# Altium schematic sheet ReflectanceDigital.SchDoc
size A4; SheetNumber: 1; SheetTotal: 1
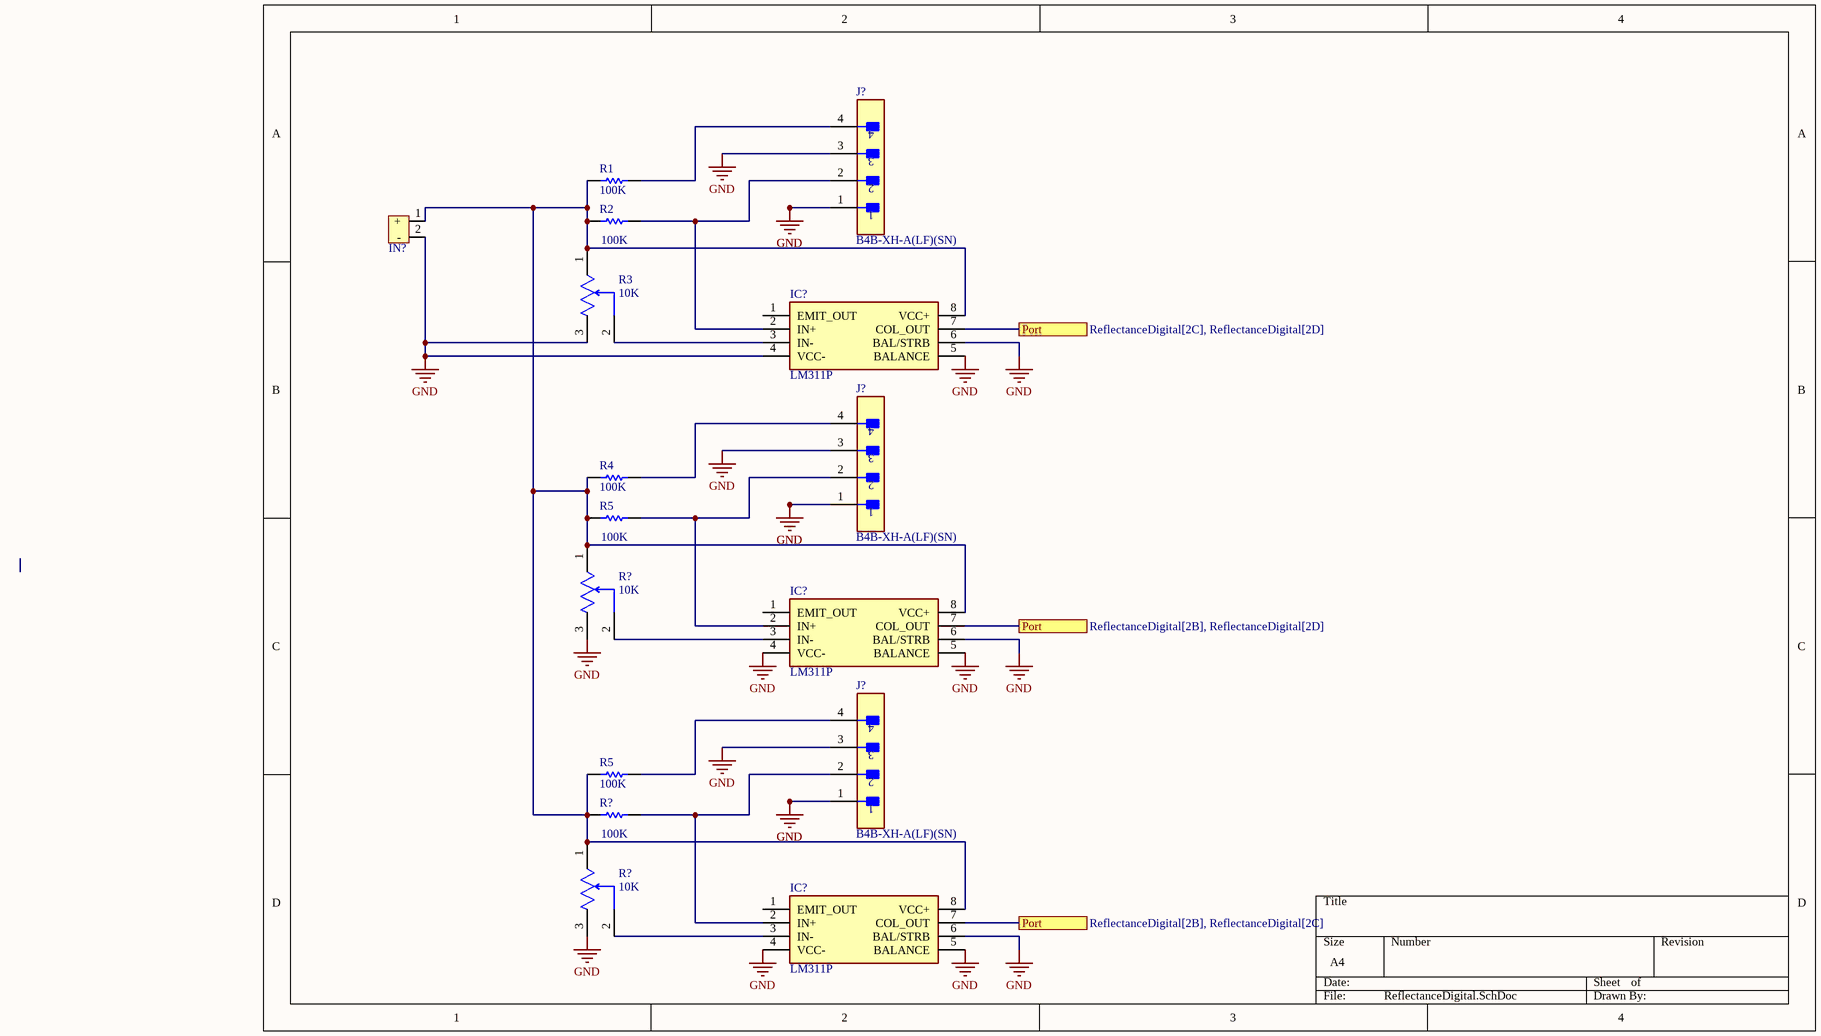
[diagram p0: ReflectanceDigital.SchDoc]

## Parts
(Parts that share a designator on the sheet are numbered #1, #2 ... from top to bottom, then left to right.)
IC?#1  LM311P  [DIP794W53P254L959H508Q8N]
IC?#2  LM311P  [DIP794W53P254L959H508Q8N]
IC?#3  LM311P  [DIP794W53P254L959H508Q8N]
IN?  Header  [Header]  (value not drawn)
J?#1  B4B-XH-A(LF)(SN)  [FP-B4B-XH-A_LF_SN-MFG]
J?#2  B4B-XH-A(LF)(SN)  [FP-B4B-XH-A_LF_SN-MFG]
J?#3  B4B-XH-A(LF)(SN)  [FP-B4B-XH-A_LF_SN-MFG]
R1  100K  [RESA60-630X240]
R2  100K  [RESA60-630X240]
R3  10K  [FP-3296W-MFG]
R4  100K  [RESA60-630X240]
R5#1  100K  [RESA60-630X240]
R5#2  100K  [RESA60-630X240]
R?#1  10K  [FP-3296W-MFG]
R?#2  100K  [RESA60-630X240]
R?#3  10K  [FP-3296W-MFG]

## Ports
Port (see ReflectanceDigital[2B], ReflectanceDigital[2C]), Port (see ReflectanceDigital[2B], ReflectanceDigital[2D]), Port (see ReflectanceDigital[2C], ReflectanceDigital[2D])

## Nets
GND: IC?#1.4(VCC-) IC?#1.5(BALANCE) IC?#1.6(BAL/STRB) IC?#2.4(VCC-) IC?#2.5(BALANCE) IC?#2.6(BAL/STRB) IC?#3.4(VCC-) IC?#3.5(BALANCE) IC?#3.6(BAL/STRB) IN?.2(-) J?#1.1 J?#1.3 J?#2.1 J?#2.3 J?#3.1 J?#3.3 R3.3(CW) R?#1.3(CW) R?#3.3(CW)
Port: IC?#1.7(COL_OUT) IC?#2.7(COL_OUT) IC?#3.7(COL_OUT) ; port Port
NetIC?#1_2: IC?#1.2(IN+) J?#1.2 R2.2
NetIC?#1_3: IC?#1.3(IN-) R3.2(WIPER)
NetIC?#1_8: IC?#1.8(VCC+) IC?#2.8(VCC+) IC?#3.8(VCC+) IN?.1(+) R1.1 R2.1 R3.1(CCW) R4.1 R5#1.1 R5#2.1 R?#1.1(CCW) R?#2.1 R?#3.1(CCW)
NetIC?#2_2: IC?#2.2(IN+) J?#2.2 R5#1.2
NetIC?#2_3: IC?#2.3(IN-) R?#1.2(WIPER)
NetIC?#3_2: IC?#3.2(IN+) J?#3.2 R?#2.2
NetIC?#3_3: IC?#3.3(IN-) R?#3.2(WIPER)
NetJ?#1_4: J?#1.4 R1.2
NetJ?#2_4: J?#2.4 R4.2
NetJ?#3_4: J?#3.4 R5#2.2

Not connected (* = marked no-connect by the designer): IC?#1 1(EMIT_OUT); IC?#2 1(EMIT_OUT); IC?#3 1(EMIT_OUT)

## Library data of the parts
IC?#1-IC?#3 = LM311P: Integrated Circuit; Manufacturer_Name: Texas Instruments; Datasheet Link: http://www.ti.com/lit/ds/symlink/lm311.pdf; Height: 5.08mm; Manufacturer_Part_Number: LM311P; Mouser Part Number: 595-LM311P; Mouser Price/Stock: https://www.mouser.co.uk/ProductDetail/Texas-Instruments/LM311P?qs=0OT4q4QBUTKsKDe9sMZxLw%3D%3D; Arrow Part Number: LM311P; Arrow Price/Stock: https://www.arrow.com/en/products/lm311p/texas-instruments?region=nac
J?#1-J?#3 = CMP-17439-000250-1: CONN HEADER VERT 4POS 2.5MM; Number of Contacts: 4; Contact Resistance: 20mR; Voltage Rating: 250V; Max Current Rating: 3A; Gender: Male; Wire/Cable Gauge: 22AWG; Mated Stacking Heights: 9.8mm; Insulation Resistance: 1GR; Orientation: Straight; Contact Type: Male Pin; Contact Finish - Mating: TIN; Series: XH; Max Voltage Rating (AC): 250V; Lead Pitch: 2.5mm; Contact Shape: Square; Insulation Color: Natural; Termination: Solder; Lead Free: Lead Free; Voltage Rating (AC): 250V; Number of Rows: 1; Flammability Rating: UL94 V-0; Number of Positions: 4; Max Operating Temperature: 85°C; Package Quantity: 500; Mount: Through Hole; REACH SVHC: No SVHC; Connector Type: Header; Insulation Material: Nylon; Fastening Type: Detent; Min Operating Temperature: -25°C; Housing Color: White; Packaging: Bulk; Contact Plating: Tin; Contact Material: Brass; Max Voltage Rating (DC): 250V; Housing Material: Polyamide; Color: Natural; Material: Polyamide; Pitch: 2.5mm; Depth: 5.75mm; Current Rating: 3A; Length: 12.4mm
R1 R2 R4 R5#1 R5#2 R?#2 = CMP-1659-00073-1: Axial Resistor, 100 KOhm, +/- 1%, 0.25 W, -55 to 155 degC, 2-Pin THD, RoHS, Bulk; Voltage Rating: 250 V; Power Rating: 250 mW; Resistance: 475 Ohm; PackageDescription: 2-Pin Axial Lead, Dia 2.4 mm, Body Length 6.3 mm; PackageReference: MFR-25; Length: 0.248 inch; ComponentLink2Description: Datasheet; Packaging: Bulk; DatasheetVersion: Apr-13; Package Quantity: 200; Min Operating Temperature: -55 degC; ComponentLink2URL: http://www.yageo.com/documents/recent/Yageo%20LR_MFR_2013.pdf; RoHSCompliant: true; ComponentLink1URL: http://www.yageo.com/; Tolerance: 1%; Case\Package: Axial; Mount: Through Hole; ComponentLink1Description: Manufacturer URL; Max Operating Temperature: 155 degC
R3 R?#1 R?#3 = CMP-2000-05582-2: TRIMMER 2K OHM 0.5W PC PIN TOP; Resistance Tolerance: 10%; Max Power Dissipation: 500mW; Number of Turns: 25; Temperature Coefficient: 100ppm/°C; Resistance: 2kR; Taper: Linear; Width: 9.53mm; Radiation Hardening: No; Length: 9.53mm; Packaging: Rail/Tube; Lead Free: Lead Free; Mount: Panel; Min Operating Temperature: -55°C; Power Rating: 500mW; RoHS Compliant: Yes; REACH SVHC: No SVHC; Color: Blue; Package Quantity: 50; Contact Plating: Tin; Weight: 0.03oz; Technology: CERMET; Max Operating Temperature: 125°C; Tolerance: 10%; Termination: Pin; Resistor Type: Cermet; Military Standard: Not; Height: 0.395inch; Series: 3296; Depth: 4.83mm